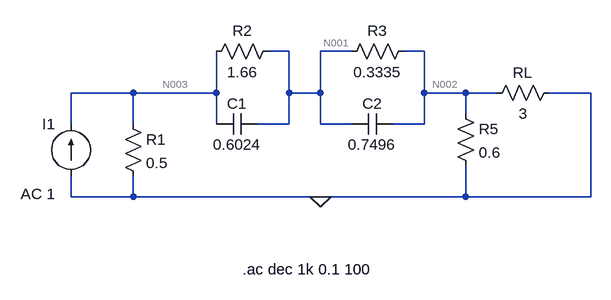
[diagram p0: schematic Punto 1.asc]
Punto 1.asc, the LTspice schematic file:
Version 4
SHEET 1 880 680
WIRE 320 64 288 64
WIRE 416 64 368 64
WIRE 528 64 496 64
WIRE 80 128 -16 128
WIRE 208 128 208 64
WIRE 208 128 80 128
WIRE 320 128 320 64
WIRE 368 128 368 64
WIRE 368 128 320 128
WIRE 528 128 528 64
WIRE 592 128 528 128
WIRE 640 128 592 128
WIRE 784 128 720 128
WIRE 592 160 592 128
WIRE -16 176 -16 128
WIRE 80 176 80 128
WIRE 208 176 208 128
WIRE 320 176 320 128
WIRE 320 176 272 176
WIRE 368 176 368 128
WIRE 416 176 368 176
WIRE 528 176 528 128
WIRE 528 176 480 176
WIRE -16 288 -16 256
WIRE 80 288 80 256
WIRE 80 288 -16 288
WIRE 368 288 80 288
WIRE 592 288 592 240
WIRE 592 288 368 288
WIRE 784 288 784 128
WIRE 784 288 592 288
FLAG 368 288 0
SYMBOL res 64 160 R0
SYMATTR InstName R1
SYMATTR Value 0.5
SYMBOL res 304 48 R90
WINDOW 0 0 56 VBottom 2
WINDOW 3 32 56 VTop 2
SYMATTR InstName R2
SYMATTR Value 1.66
SYMBOL cap 272 160 R90
WINDOW 0 0 32 VBottom 2
WINDOW 3 32 32 VTop 2
SYMATTR InstName C1
SYMATTR Value 0.6024
SYMBOL res 512 48 R90
WINDOW 0 0 56 VBottom 2
WINDOW 3 32 56 VTop 2
SYMATTR InstName R3
SYMATTR Value 0.3335
SYMBOL cap 480 160 R90
WINDOW 0 0 32 VBottom 2
WINDOW 3 32 32 VTop 2
SYMATTR InstName C2
SYMATTR Value 0.7496
SYMBOL res 736 112 R90
WINDOW 0 0 56 VBottom 2
WINDOW 3 32 56 VTop 2
SYMATTR InstName RL
SYMATTR Value 3
SYMBOL current -16 256 R180
WINDOW 0 24 80 Left 2
WINDOW 3 24 0 Left 2
WINDOW 123 24 -28 Left 2
WINDOW 39 0 0 Left 0
SYMATTR InstName I1
SYMATTR Value ""
SYMATTR Value2 AC 1
SYMBOL res 576 144 R0
SYMATTR InstName R5
SYMATTR Value 0.6
TEXT 248 400 Left 2 !.ac dec 1k 0.1 100

The netlist it stands for:
* Punto 1.asc
R1 N003 0 0.5
R2 N001 N003 1.66
C1 N001 N003 0.6024
R3 N002 N001 0.3335
C2 N002 N001 0.7496
RL 0 N002 3
I1 0 N003 AC 1
R5 N002 0 0.6
.ac dec 1k 0.1 100
.backanno
.end

* Results of the author's LTspice run, read from the files saved beside the schematic
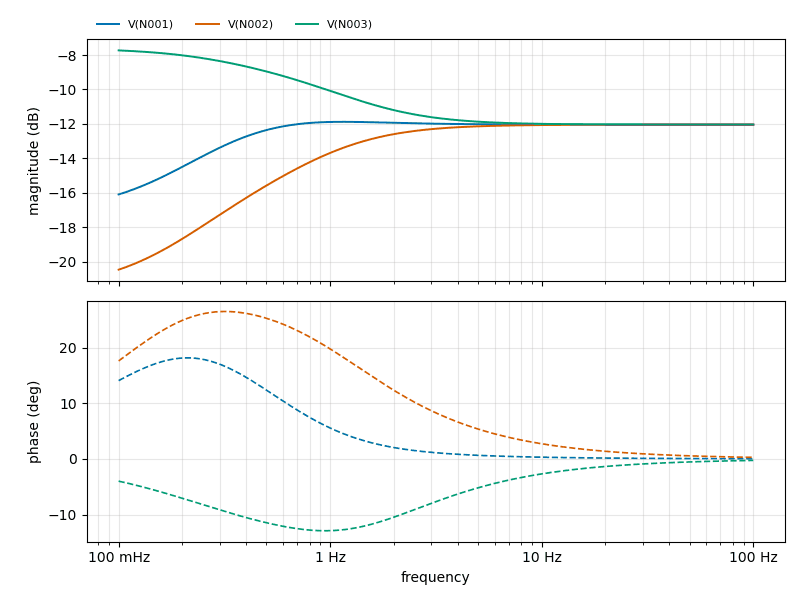
[diagram p1: AC Analysis of Punto 1.asc, plotted from the saved traces]
* AC Analysis, 1 run:
*   V(N001): -16.10 dB at 100 mHz, -12.04 dB at 100 Hz, peak -11.88 dB at 1.151 Hz, 3 dB below the peak at 173.2 mHz
*   V(N002): -20.47 dB at 100 mHz, -12.04 dB at 100 Hz, peak -12.04 dB at 100 Hz, 3 dB below the peak at 594.3 mHz
*   V(N003): -7.73 dB at 100 mHz, -12.04 dB at 100 Hz, peak -7.73 dB at 100 mHz, 3 dB below the peak at 1.458 Hz